# EAGLE schematic ClimbingWallController (EAGLE 6.4)
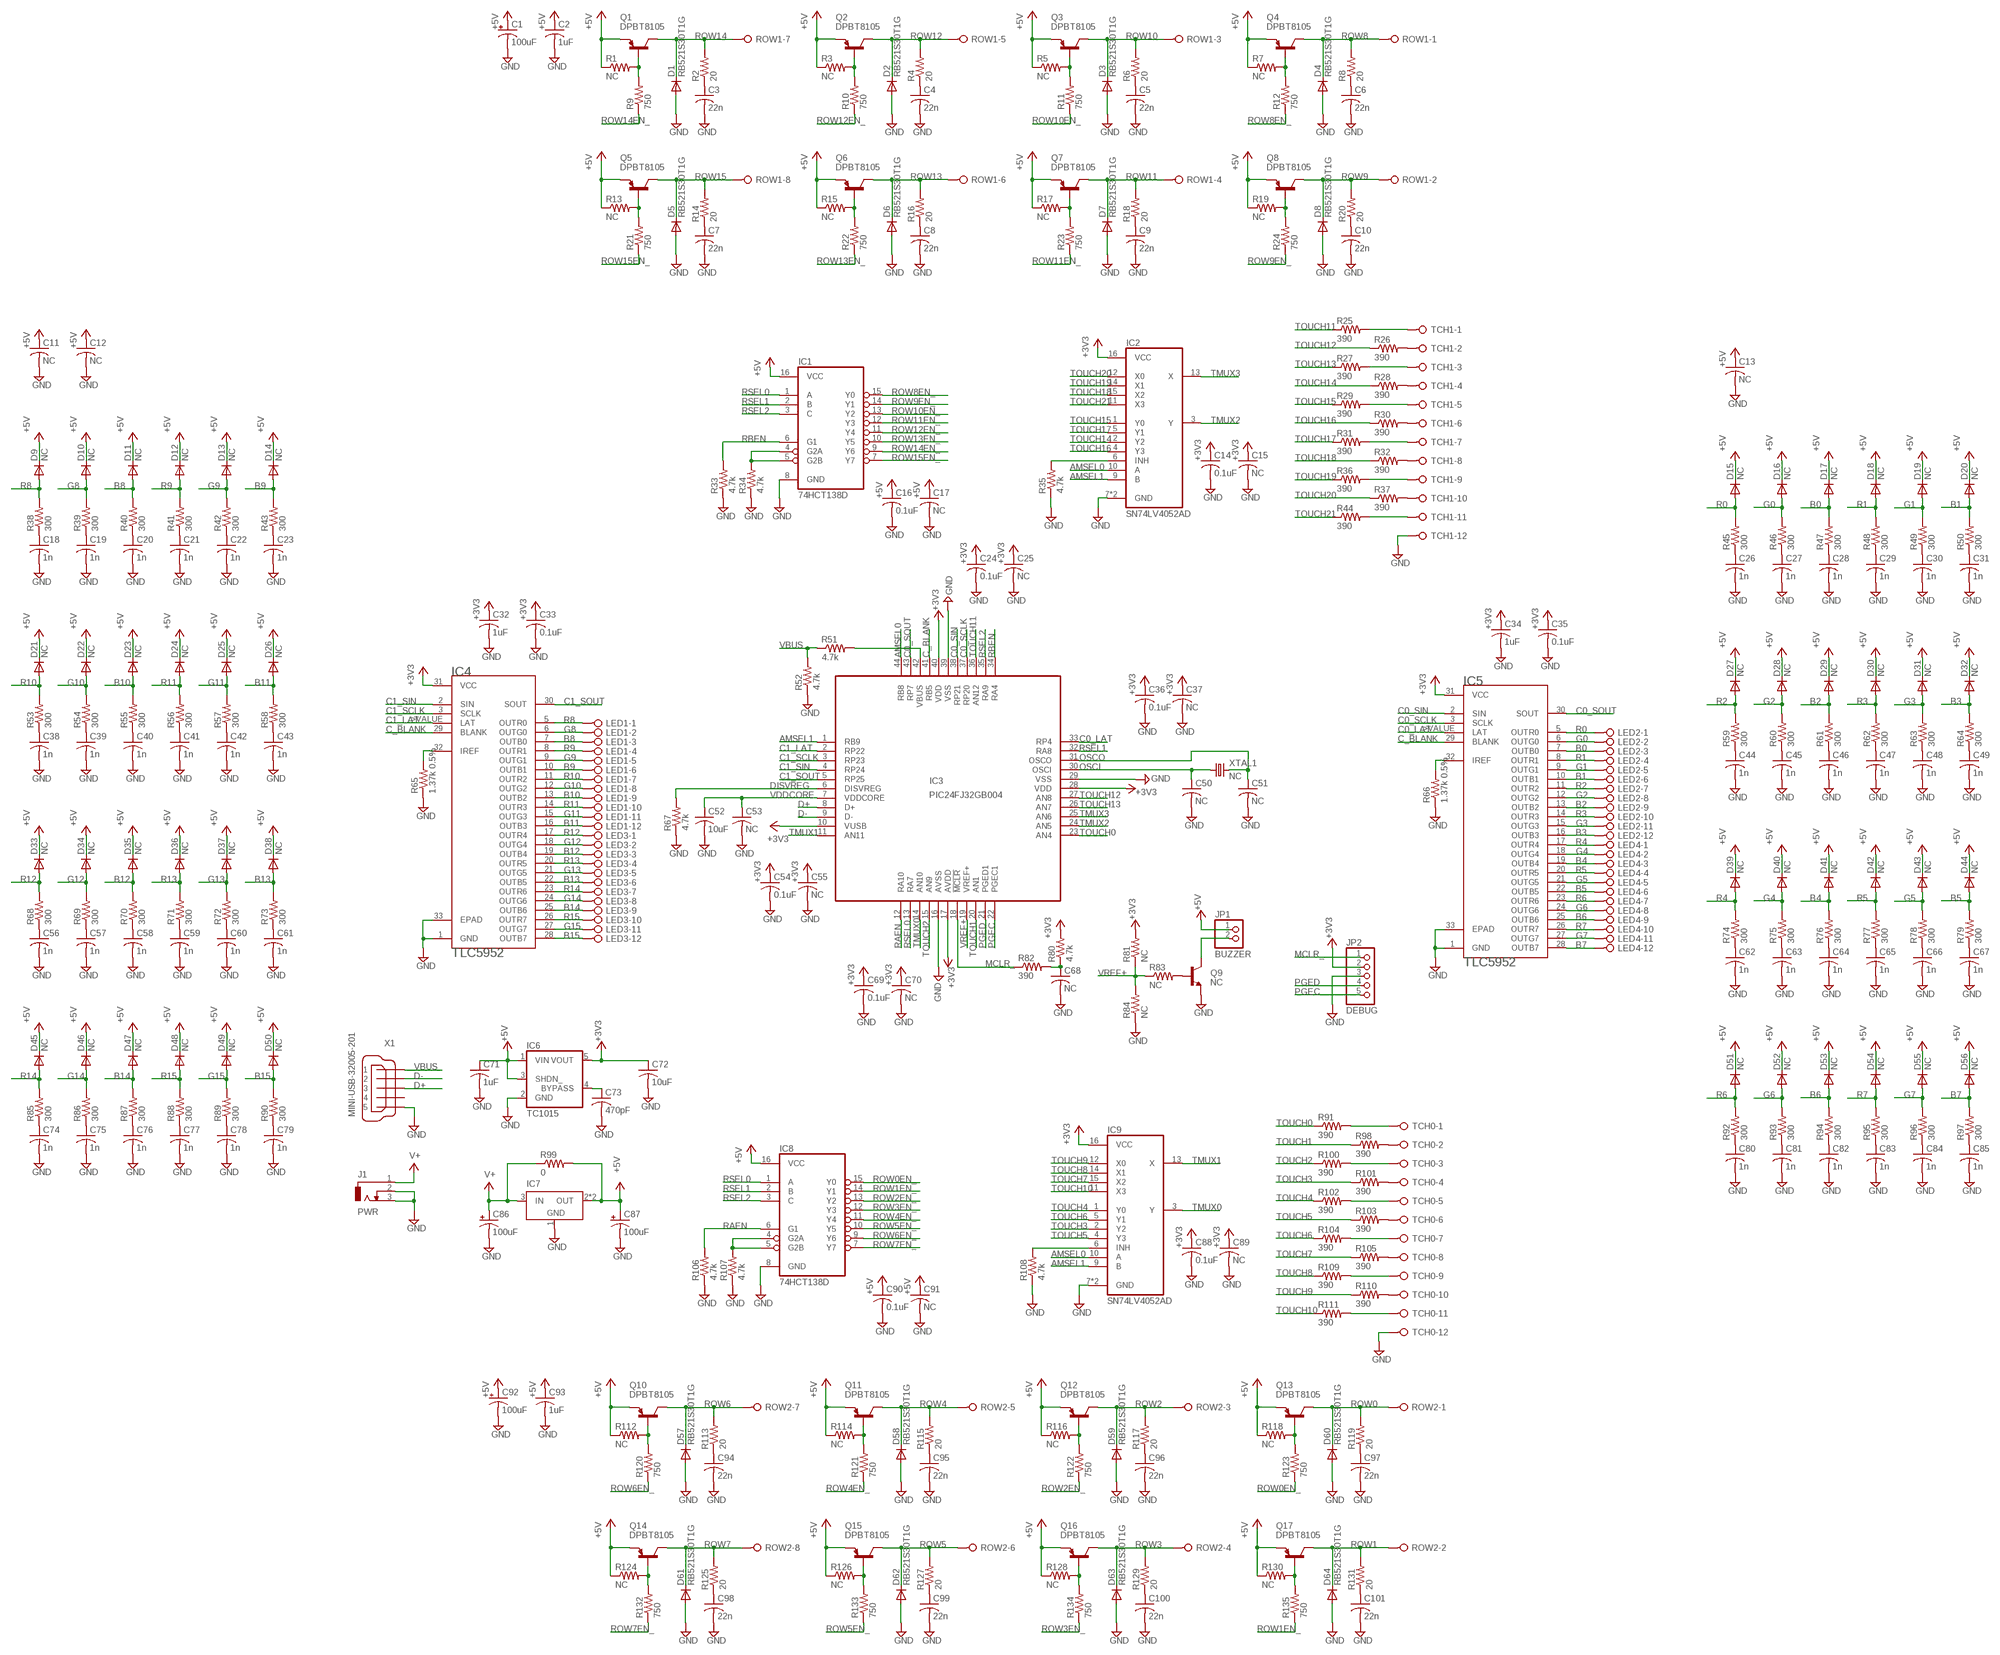
[diagram p0: schematic, sheet 1]

## Parts
C1  100uF  CPOL-USD  [PANASONIC_D]
C2  1uF  C-USC0603K  [C0603K]
C3  22n  C-USC0603K  [C0603K]
C4  22n  C-USC0603K  [C0603K]
C5  22n  C-USC0603K  [C0603K]
C6  22n  C-USC0603K  [C0603K]
C7  22n  C-USC0603K  [C0603K]
C8  22n  C-USC0603K  [C0603K]
C9  22n  C-USC0603K  [C0603K]
C10  22n  C-USC0603K  [C0603K]
C11  NC  C-USC0603K  [C0603K]
C12  NC  C-USC0603K  [C0603K]
C13  NC  C-USC0603K  [C0603K]
C14  0.1uF  C-USC0603K  [C0603K]
C15  NC  C-USC0603K  [C0603K]
C16  0.1uF  C-USC0603K  [C0603K]
C17  NC  C-USC0603K  [C0603K]
C18  1n  C-USC0603K  [C0603K]
C19  1n  C-USC0603K  [C0603K]
C20  1n  C-USC0603K  [C0603K]
C21  1n  C-USC0603K  [C0603K]
C22  1n  C-USC0603K  [C0603K]
C23  1n  C-USC0603K  [C0603K]
C24  0.1uF  C-USC0603K  [C0603K]
C25  NC  C-USC0603K  [C0603K]
C26  1n  C-USC0603K  [C0603K]
C27  1n  C-USC0603K  [C0603K]
C28  1n  C-USC0603K  [C0603K]
C29  1n  C-USC0603K  [C0603K]
C30  1n  C-USC0603K  [C0603K]
C31  1n  C-USC0603K  [C0603K]
C32  1uF  C-USC0603K  [C0603K]
C33  0.1uF  C-USC0603K  [C0603K]
C34  1uF  C-USC0603K  [C0603K]
C35  0.1uF  C-USC0603K  [C0603K]
C36  0.1uF  C-USC0603K  [C0603K]
C37  NC  C-USC0603K  [C0603K]
C38  1n  C-USC0603K  [C0603K]
C39  1n  C-USC0603K  [C0603K]
C40  1n  C-USC0603K  [C0603K]
C41  1n  C-USC0603K  [C0603K]
C42  1n  C-USC0603K  [C0603K]
C43  1n  C-USC0603K  [C0603K]
C44  1n  C-USC0603K  [C0603K]
C45  1n  C-USC0603K  [C0603K]
C46  1n  C-USC0603K  [C0603K]
C47  1n  C-USC0603K  [C0603K]
C48  1n  C-USC0603K  [C0603K]
C49  1n  C-USC0603K  [C0603K]
C50  NC  C-USC0603K  [C0603K]
C51  NC  C-USC0603K  [C0603K]
C52  10uF  C-USC1206K  [C1206K]
C53  NC  C-USC0603K  [C0603K]
C54  0.1uF  C-USC0603K  [C0603K]
C55  NC  C-USC0603K  [C0603K]
C56  1n  C-USC0603K  [C0603K]
C57  1n  C-USC0603K  [C0603K]
C58  1n  C-USC0603K  [C0603K]
C59  1n  C-USC0603K  [C0603K]
C60  1n  C-USC0603K  [C0603K]
C61  1n  C-USC0603K  [C0603K]
C62  1n  C-USC0603K  [C0603K]
C63  1n  C-USC0603K  [C0603K]
C64  1n  C-USC0603K  [C0603K]
C65  1n  C-USC0603K  [C0603K]
C66  1n  C-USC0603K  [C0603K]
C67  1n  C-USC0603K  [C0603K]
C68  NC  C-USC0603K  [C0603K]
C69  0.1uF  C-USC0603K  [C0603K]
C70  NC  C-USC0603K  [C0603K]
C71  1uF  C-USC0603K  [C0603K]
C72  10uF  C-USC1206K  [C1206K]
C73  470pF  C-USC0603K  [C0603K]
C74  1n  C-USC0603K  [C0603K]
C75  1n  C-USC0603K  [C0603K]
C76  1n  C-USC0603K  [C0603K]
C77  1n  C-USC0603K  [C0603K]
C78  1n  C-USC0603K  [C0603K]
C79  1n  C-USC0603K  [C0603K]
C80  1n  C-USC0603K  [C0603K]
C81  1n  C-USC0603K  [C0603K]
C82  1n  C-USC0603K  [C0603K]
C83  1n  C-USC0603K  [C0603K]
C84  1n  C-USC0603K  [C0603K]
C85  1n  C-USC0603K  [C0603K]
C86  100uF  CPOL-USD  [PANASONIC_D]
C87  100uF  CPOL-USD  [PANASONIC_D]
C88  0.1uF  C-USC0603K  [C0603K]
C89  NC  C-USC0603K  [C0603K]
C90  0.1uF  C-USC0603K  [C0603K]
C91  NC  C-USC0603K  [C0603K]
C92  100uF  CPOL-USD  [PANASONIC_D]
C93  1uF  C-USC0603K  [C0603K]
C94  22n  C-USC0603K  [C0603K]
C95  22n  C-USC0603K  [C0603K]
C96  22n  C-USC0603K  [C0603K]
C97  22n  C-USC0603K  [C0603K]
C98  22n  C-USC0603K  [C0603K]
C99  22n  C-USC0603K  [C0603K]
C100  22n  C-USC0603K  [C0603K]
C101  22n  C-USC0603K  [C0603K]
D1  RB521S30T1G  DIODE-SOD523  [SOD523]
D2  RB521S30T1G  DIODE-SOD523  [SOD523]
D3  RB521S30T1G  DIODE-SOD523  [SOD523]
D4  RB521S30T1G  DIODE-SOD523  [SOD523]
D5  RB521S30T1G  DIODE-SOD523  [SOD523]
D6  RB521S30T1G  DIODE-SOD523  [SOD523]
D7  RB521S30T1G  DIODE-SOD523  [SOD523]
D8  RB521S30T1G  DIODE-SOD523  [SOD523]
D9  NC  DIODE-SOD523  [SOD523]
D10  NC  DIODE-SOD523  [SOD523]
D11  NC  DIODE-SOD523  [SOD523]
D12  NC  DIODE-SOD523  [SOD523]
D13  NC  DIODE-SOD523  [SOD523]
D14  NC  DIODE-SOD523  [SOD523]
D15  NC  DIODE-SOD523  [SOD523]
D16  NC  DIODE-SOD523  [SOD523]
D17  NC  DIODE-SOD523  [SOD523]
D18  NC  DIODE-SOD523  [SOD523]
D19  NC  DIODE-SOD523  [SOD523]
D20  NC  DIODE-SOD523  [SOD523]
D21  NC  DIODE-SOD523  [SOD523]
D22  NC  DIODE-SOD523  [SOD523]
D23  NC  DIODE-SOD523  [SOD523]
D24  NC  DIODE-SOD523  [SOD523]
D25  NC  DIODE-SOD523  [SOD523]
D26  NC  DIODE-SOD523  [SOD523]
D27  NC  DIODE-SOD523  [SOD523]
D28  NC  DIODE-SOD523  [SOD523]
D29  NC  DIODE-SOD523  [SOD523]
D30  NC  DIODE-SOD523  [SOD523]
D31  NC  DIODE-SOD523  [SOD523]
D32  NC  DIODE-SOD523  [SOD523]
D33  NC  DIODE-SOD523  [SOD523]
D34  NC  DIODE-SOD523  [SOD523]
D35  NC  DIODE-SOD523  [SOD523]
D36  NC  DIODE-SOD523  [SOD523]
D37  NC  DIODE-SOD523  [SOD523]
D38  NC  DIODE-SOD523  [SOD523]
D39  NC  DIODE-SOD523  [SOD523]
D40  NC  DIODE-SOD523  [SOD523]
D41  NC  DIODE-SOD523  [SOD523]
D42  NC  DIODE-SOD523  [SOD523]
D43  NC  DIODE-SOD523  [SOD523]
D44  NC  DIODE-SOD523  [SOD523]
D45  NC  DIODE-SOD523  [SOD523]
D46  NC  DIODE-SOD523  [SOD523]
D47  NC  DIODE-SOD523  [SOD523]
D48  NC  DIODE-SOD523  [SOD523]
D49  NC  DIODE-SOD523  [SOD523]
D50  NC  DIODE-SOD523  [SOD523]
D51  NC  DIODE-SOD523  [SOD523]
D52  NC  DIODE-SOD523  [SOD523]
D53  NC  DIODE-SOD523  [SOD523]
D54  NC  DIODE-SOD523  [SOD523]
D55  NC  DIODE-SOD523  [SOD523]
D56  NC  DIODE-SOD523  [SOD523]
D57  RB521S30T1G  DIODE-SOD523  [SOD523]
D58  RB521S30T1G  DIODE-SOD523  [SOD523]
D59  RB521S30T1G  DIODE-SOD523  [SOD523]
D60  RB521S30T1G  DIODE-SOD523  [SOD523]
D61  RB521S30T1G  DIODE-SOD523  [SOD523]
D62  RB521S30T1G  DIODE-SOD523  [SOD523]
D63  RB521S30T1G  DIODE-SOD523  [SOD523]
D64  RB521S30T1G  DIODE-SOD523  [SOD523]
IC1  74HCT138D  [SO16]
IC2  SN74LV4052AD  [SO16]
IC3  PIC24FJ32GB004  [TQFP44]
IC4  TLC5952  [HTSSOP-32POWERPAD]
IC5  TLC5952  [HTSSOP-32POWERPAD]
IC6  TC1015  [SOT23-5L]
IC7  NCP1117  [SOT223]
IC8  74HCT138D  [SO16]
IC9  SN74LV4052AD  [SO16]
J1  PWR  DCJ0303  [DCJ0303]
JP1  BUZZER  PINHD-1X2  [1X02]
JP2  DEBUG  PINHD-1X5  [1X05]
LED1  OSTVN12A150  [OSTVN12]
LED2  OSTVN12A150  [OSTVN12]
LED3  OSTVN12A150  [OSTVN12]
LED4  OSTVN12A150  [OSTVN12]
Q1  DPBT8105  [SOT23]
Q2  DPBT8105  [SOT23]
Q3  DPBT8105  [SOT23]
Q4  DPBT8105  [SOT23]
Q5  DPBT8105  [SOT23]
Q6  DPBT8105  [SOT23]
Q7  DPBT8105  [SOT23]
Q8  DPBT8105  [SOT23]
Q9  NC  BC847A-NPN-SOT23-BEC  [SOT23-BEC]
Q10  DPBT8105  [SOT23]
Q11  DPBT8105  [SOT23]
Q12  DPBT8105  [SOT23]
Q13  DPBT8105  [SOT23]
Q14  DPBT8105  [SOT23]
Q15  DPBT8105  [SOT23]
Q16  DPBT8105  [SOT23]
Q17  DPBT8105  [SOT23]
R1  NC  R-US_R0603  [R0603]
R2  20  R-US_R0603  [R0603]
R3  NC  R-US_R0603  [R0603]
R4  20  R-US_R0603  [R0603]
R5  NC  R-US_R0603  [R0603]
R6  20  R-US_R0603  [R0603]
R7  NC  R-US_R0603  [R0603]
R8  20  R-US_R0603  [R0603]
R9  750  R-US_R0603  [R0603]
R10  750  R-US_R0603  [R0603]
R11  750  R-US_R0603  [R0603]
R12  750  R-US_R0603  [R0603]
R13  NC  R-US_R0603  [R0603]
R14  20  R-US_R0603  [R0603]
R15  NC  R-US_R0603  [R0603]
R16  20  R-US_R0603  [R0603]
R17  NC  R-US_R0603  [R0603]
R18  20  R-US_R0603  [R0603]
R19  NC  R-US_R0603  [R0603]
R20  20  R-US_R0603  [R0603]
R21  750  R-US_R0603  [R0603]
R22  750  R-US_R0603  [R0603]
R23  750  R-US_R0603  [R0603]
R24  750  R-US_R0603  [R0603]
R25  390  R-US_R0603  [R0603]
R26  390  R-US_R0603  [R0603]
R27  390  R-US_R0603  [R0603]
R28  390  R-US_R0603  [R0603]
R29  390  R-US_R0603  [R0603]
R30  390  R-US_R0603  [R0603]
R31  390  R-US_R0603  [R0603]
R32  390  R-US_R0603  [R0603]
R33  4.7k  R-US_R0603  [R0603]
R34  4.7k  R-US_R0603  [R0603]
R35  4.7k  R-US_R0603  [R0603]
R36  390  R-US_R0603  [R0603]
R37  390  R-US_R0603  [R0603]
R38  300  R-US_R0603  [R0603]
R39  300  R-US_R0603  [R0603]
R40  300  R-US_R0603  [R0603]
R41  300  R-US_R0603  [R0603]
R42  300  R-US_R0603  [R0603]
R43  300  R-US_R0603  [R0603]
R44  390  R-US_R0603  [R0603]
R45  300  R-US_R0603  [R0603]
R46  300  R-US_R0603  [R0603]
R47  300  R-US_R0603  [R0603]
R48  300  R-US_R0603  [R0603]
R49  300  R-US_R0603  [R0603]
R50  300  R-US_R0603  [R0603]
R51  4.7k  R-US_R0603  [R0603]
R52  4.7k  R-US_R0603  [R0603]
R53  300  R-US_R0603  [R0603]
R54  300  R-US_R0603  [R0603]
R55  300  R-US_R0603  [R0603]
R56  300  R-US_R0603  [R0603]
R57  300  R-US_R0603  [R0603]
R58  300  R-US_R0603  [R0603]
R59  300  R-US_R0603  [R0603]
R60  300  R-US_R0603  [R0603]
R61  300  R-US_R0603  [R0603]
R62  300  R-US_R0603  [R0603]
R63  300  R-US_R0603  [R0603]
R64  300  R-US_R0603  [R0603]
R65  1.37k 0.5%  R-US_R0805  [R0805]
R66  1.37k 0.5%  R-US_R0805  [R0805]
R67  4.7k  R-US_R0603  [R0603]
R68  300  R-US_R0603  [R0603]
R69  300  R-US_R0603  [R0603]
R70  300  R-US_R0603  [R0603]
R71  300  R-US_R0603  [R0603]
R72  300  R-US_R0603  [R0603]
R73  300  R-US_R0603  [R0603]
R74  300  R-US_R0603  [R0603]
R75  300  R-US_R0603  [R0603]
R76  300  R-US_R0603  [R0603]
R77  300  R-US_R0603  [R0603]
R78  300  R-US_R0603  [R0603]
R79  300  R-US_R0603  [R0603]
R80  4.7k  R-US_R0603  [R0603]
R81  NC  R-US_R0603  [R0603]
R82  390  R-US_R0603  [R0603]
R83  NC  R-US_R0603  [R0603]
R84  NC  R-US_R0603  [R0603]
R85  300  R-US_R0603  [R0603]
R86  300  R-US_R0603  [R0603]
R87  300  R-US_R0603  [R0603]
R88  300  R-US_R0603  [R0603]
R89  300  R-US_R0603  [R0603]
R90  300  R-US_R0603  [R0603]
R91  390  R-US_R0603  [R0603]
R92  300  R-US_R0603  [R0603]
R93  300  R-US_R0603  [R0603]
R94  300  R-US_R0603  [R0603]
R95  300  R-US_R0603  [R0603]
R96  300  R-US_R0603  [R0603]
R97  300  R-US_R0603  [R0603]
R98  390  R-US_R0603  [R0603]
R99  0  R-US_R0805  [R0805]
R100  390  R-US_R0603  [R0603]
R101  390  R-US_R0603  [R0603]
R102  390  R-US_R0603  [R0603]
R103  390  R-US_R0603  [R0603]
R104  390  R-US_R0603  [R0603]
R105  390  R-US_R0603  [R0603]
R106  4.7k  R-US_R0603  [R0603]
R107  4.7k  R-US_R0603  [R0603]
R108  4.7k  R-US_R0603  [R0603]
R109  390  R-US_R0603  [R0603]
R110  390  R-US_R0603  [R0603]
R111  390  R-US_R0603  [R0603]
R112  NC  R-US_R0603  [R0603]
R113  20  R-US_R0603  [R0603]
R114  NC  R-US_R0603  [R0603]
R115  20  R-US_R0603  [R0603]
R116  NC  R-US_R0603  [R0603]
R117  20  R-US_R0603  [R0603]
R118  NC  R-US_R0603  [R0603]
R119  20  R-US_R0603  [R0603]
R120  750  R-US_R0603  [R0603]
R121  750  R-US_R0603  [R0603]
R122  750  R-US_R0603  [R0603]
R123  750  R-US_R0603  [R0603]
R124  NC  R-US_R0603  [R0603]
R125  20  R-US_R0603  [R0603]
R126  NC  R-US_R0603  [R0603]
R127  20  R-US_R0603  [R0603]
R128  NC  R-US_R0603  [R0603]
R129  20  R-US_R0603  [R0603]
R130  NC  R-US_R0603  [R0603]
R131  20  R-US_R0603  [R0603]
R132  750  R-US_R0603  [R0603]
R133  750  R-US_R0603  [R0603]
R134  750  R-US_R0603  [R0603]
R135  750  R-US_R0603  [R0603]
ROW1  OSTVN08A150  [OSTVN08]
ROW2  OSTVN08A150  [OSTVN08]
TCH0  OSTVN12A150  [OSTVN12]
TCH1  OSTVN12A150  [OSTVN12]
X1  MINI-USB-32005-201  [32005-201]
XTAL1  NC  CRY5032  [NX5032]

## Nets
+3V3: C14.1 C15.1 C24.1 C25.1 C32.1 C33.1 C34.1 C35.1 C36.1 C37.1 C54.1 C55.1 C69.1 C70.1 C72.1 C88.1 C89.1 IC2.16(VCC) IC3.10(VUSB) IC3.17(AVDD) IC3.28(VDD) IC3.40(VDD) IC4.31(VCC) IC5.31(VCC) IC6.5(VOUT) IC9.16(VCC) JP2.2 R80.2 R81.2
+5V: C1.+ C2.1 C11.1 C12.1 C13.1 C16.1 C17.1 C71.1 C87.+ C90.1 C91.1 C92.+ C93.1 D9.C D10.C D11.C D12.C D13.C D14.C D15.C D16.C D17.C D18.C D19.C D20.C D21.C D22.C D23.C D24.C D25.C D26.C D27.C D28.C D29.C D30.C D31.C D32.C D33.C D34.C D35.C D36.C D37.C D38.C D39.C D40.C D41.C D42.C D43.C D44.C D45.C D46.C D47.C D48.C D49.C D50.C D51.C D52.C D53.C D54.C D55.C D56.C IC1.16(VCC) IC6.1(VIN) IC6.3(SHDN_) IC7.2(OUT) IC7.4(OUT) IC8.16(VCC) JP1.1 Q1.2(E) Q2.2(E) Q3.2(E) Q4.2(E) Q5.2(E) Q6.2(E) Q7.2(E) Q8.2(E) Q10.2(E) Q11.2(E) Q12.2(E) Q13.2(E) Q14.2(E) Q15.2(E) Q16.2(E) Q17.2(E) R1.1 R3.1 R5.1 R7.1 R13.1 R15.1 R17.1 R19.1 R99.2 R112.1 R114.1 R116.1 R118.1 R124.1 R126.1 R128.1 R130.1
AMSEL0: IC2.10(A) IC3.44(RB8) IC9.10(A)
AMSEL1: IC2.9(B) IC3.1(RB9) IC9.9(B)
B0: D17.A IC5.7(OUTB0) LED2.3 R47.2
B1: D20.A IC5.10(OUTB1) LED2.6 R50.2
B2: D29.A IC5.13(OUTB2) LED2.9 R61.2
B3: D32.A IC5.16(OUTB3) LED2.12 R64.2
B4: D41.A IC5.19(OUTB4) LED4.3 R76.2
B5: D44.A IC5.22(OUTB5) LED4.6 R79.2
B6: D53.A IC5.25(OUTB6) LED4.9 R94.2
B7: D56.A IC5.28(OUTB7) LED4.12 R97.2
B8: D11.A IC4.7(OUTB0) LED1.3 R40.2
B9: D14.A IC4.10(OUTB1) LED1.6 R43.2
B10: D23.A IC4.13(OUTB2) LED1.9 R55.2
B11: D26.A IC4.16(OUTB3) LED1.12 R58.2
B12: D35.A IC4.19(OUTB4) LED3.3 R70.2
B13: D38.A IC4.22(OUTB5) LED3.6 R73.2
B14: D47.A IC4.25(OUTB6) LED3.9 R87.2
B15: D50.A IC4.28(OUTB7) LED3.12 R90.2
C0_LAT: IC3.33(RP4) IC5.>VALUE(LAT)
C0_SCLK: IC3.37(RP20) IC5.3(SCLK)
C0_SIN: IC3.38(RP21) IC5.2(SIN)
C0_SOUT: IC3.43(RP7) IC5.30(SOUT)
C1_LAT: IC3.2(RP22) IC4.>VALUE(LAT)
C1_SCLK: IC3.3(RP23) IC4.3(SCLK)
C1_SIN: IC3.4(RP24) IC4.2(SIN)
C1_SOUT: IC3.5(RP25) IC4.30(SOUT)
C_BLANK: IC3.41(RB5) IC4.29(BLANK) IC5.29(BLANK)
CAIREF: IC5.32(IREF) R66.2
CAIREF1: IC4.32(IREF) R65.2
D+: IC3.8(D+) X1.3
D-: IC3.9(D-) X1.2
DISVREG: IC3.6(DISVREG) R67.2
G0: D16.A IC5.6(OUTG0) LED2.2 R46.2
G1: D19.A IC5.9(OUTG1) LED2.5 R49.2
G2: D28.A IC5.12(OUTG2) LED2.8 R60.2
G3: D31.A IC5.15(OUTG3) LED2.11 R63.2
G4: D40.A IC5.18(OUTG4) LED4.2 R75.2
G5: D43.A IC5.21(OUTG5) LED4.5 R78.2
G6: D52.A IC5.24(OUTG6) LED4.8 R93.2
G7: D55.A IC5.27(OUTG7) LED4.11 R96.2
G8: D10.A IC4.6(OUTG0) LED1.2 R39.2
G9: D13.A IC4.9(OUTG1) LED1.5 R42.2
G10: D22.A IC4.12(OUTG2) LED1.8 R54.2
G11: D25.A IC4.15(OUTG3) LED1.11 R57.2
G12: D34.A IC4.18(OUTG4) LED3.2 R69.2
G13: D37.A IC4.21(OUTG5) LED3.5 R72.2
G14: D46.A IC4.24(OUTG6) LED3.8 R86.2
G15: D49.A IC4.27(OUTG7) LED3.11 R89.2
GND: C1.- C2.2 C3.2 C4.2 C5.2 C6.2 C7.2 C8.2 C9.2 C10.2 C11.2 C12.2 C13.2 C14.2 C15.2 C16.2 C17.2 C18.2 C19.2 C20.2 C21.2 C22.2 C23.2 C24.2 C25.2 C26.2 C27.2 C28.2 C29.2 C30.2 C31.2 C32.2 C33.2 C34.2 C35.2 C36.2 C37.2 C38.2 C39.2 C40.2 C41.2 C42.2 C43.2 C44.2 C45.2 C46.2 C47.2 C48.2 C49.2 C50.2 C51.2 C52.2 C53.2 C54.2 C55.2 C56.2 C57.2 C58.2 C59.2 C60.2 C61.2 C62.2 C63.2 C64.2 C65.2 C66.2 C67.2 C68.2 C69.2 C70.2 C71.2 C72.2 C73.2 C74.2 C75.2 C76.2 C77.2 C78.2 C79.2 C80.2 C81.2 C82.2 C83.2 C84.2 C85.2 C86.- C87.- C88.2 C89.2 C90.2 C91.2 C92.- C93.2 C94.2 C95.2 C96.2 C97.2 C98.2 C99.2 C100.2 C101.2 D1.A D2.A D3.A D4.A D5.A D6.A D7.A D8.A D57.A D58.A D59.A D60.A D61.A D62.A D63.A D64.A IC1.8(GND) IC2.7(GND) IC2.8(GND) IC3.16(AVSS) IC3.29(VSS) IC3.39(VSS) IC4.1(GND) IC4.33(EPAD) IC5.1(GND) IC5.33(EPAD) IC6.2(GND) IC7.1(GND) IC8.8(GND) IC9.7(GND) IC9.8(GND) J1.2 J1.3 JP2.3 Q9.E R33.1 R34.1 R35.1 R52.1 R65.1 R66.1 R67.1 R84.1 R106.1 R107.1 R108.1 TCH0.12 TCH1.12 X1.5
MCLR_: IC3.18(!MCLR) JP2.1 R82.1
N$1: Q13.1(B) R118.2 R123.2
N$2: C97.1 R119.1
N$3: Q12.1(B) R116.2 R122.2
N$4: C96.1 R117.1
N$5: Q16.1(B) R128.2 R134.2
N$6: C100.1 R129.1
N$7: Q15.1(B) R126.2 R133.2
N$8: C99.1 R127.1
N$9: Q11.1(B) R114.2 R121.2
N$10: C95.1 R115.1
N$11: Q10.1(B) R112.2 R120.2
N$12: C94.1 R113.1
N$13: Q14.1(B) R124.2 R132.2
N$14: C98.1 R125.1
N$15: Q8.1(B) R19.2 R24.2
N$16: C10.1 R20.1
N$17: Q4.1(B) R7.2 R12.2
N$18: C6.1 R8.1
N$19: Q3.1(B) R5.2 R11.2
N$20: C5.1 R6.1
N$21: Q7.1(B) R17.2 R23.2
N$22: C9.1 R18.1
N$23: Q6.1(B) R15.2 R22.2
N$24: C8.1 R16.1
N$25: Q2.1(B) R3.2 R10.2
N$26: C4.1 R4.1
N$27: Q1.1(B) R1.2 R9.2
N$28: C3.1 R2.1
N$29: Q5.1(B) R13.2 R21.2
N$30: C7.1 R14.1
N$31: R98.2 TCH0.2
N$32: R101.2 TCH0.4
N$33: Q17.1(B) R130.2 R135.2
N$34: C101.1 R131.1
N$35: R103.2 TCH0.6
N$36: R105.2 TCH0.8
N$37: R110.2 TCH0.10
N$38: R26.2 TCH1.2
N$39: R28.2 TCH1.4
N$40: R30.2 TCH1.6
N$41: IC8.4(G2A) IC8.5(G2B) R107.2
N$42: IC9.6(INH) R108.2
N$43: IC1.4(G2A) IC1.5(G2B) R34.2
N$44: IC2.6(INH) R35.2
N$45: IC3.42(VBUS) R51.2
N$46: C68.1 R80.1 R82.2
N$47: R91.2 TCH0.1
N$48: R32.2 TCH1.8
N$49: R37.2 TCH1.10
N$50: Q9.B R83.2
N$65: R100.2 TCH0.3
N$67: R102.2 TCH0.5
N$69: R104.2 TCH0.7
N$71: R109.2 TCH0.9
N$73: R111.2 TCH0.11
N$79: R25.2 TCH1.1
N$80: R27.2 TCH1.3
N$81: R29.2 TCH1.5
N$82: R31.2 TCH1.7
N$83: R36.2 TCH1.9
N$84: R44.2 TCH1.11
N$85: C73.1 IC6.4(BYPASS)
N$88: JP1.2 Q9.C
N$89: C26.1 R45.1
N$90: C27.1 R46.1
N$91: C28.1 R47.1
N$92: C29.1 R48.1
N$93: C30.1 R49.1
N$94: C31.1 R50.1
N$95: C44.1 R59.1
N$96: C45.1 R60.1
N$97: C46.1 R61.1
N$98: C47.1 R62.1
N$99: C48.1 R63.1
N$100: C49.1 R64.1
N$101: C62.1 R74.1
N$102: C63.1 R75.1
N$103: C64.1 R76.1
N$104: C65.1 R77.1
N$105: C66.1 R78.1
N$106: C67.1 R79.1
N$107: C80.1 R92.1
N$108: C81.1 R93.1
N$109: C82.1 R94.1
N$110: C83.1 R95.1
N$111: C84.1 R96.1
N$112: C85.1 R97.1
N$114: C18.1 R38.1
N$116: C19.1 R39.1
N$118: C20.1 R40.1
N$120: C21.1 R41.1
N$122: C22.1 R42.1
N$124: C23.1 R43.1
N$126: C38.1 R53.1
N$128: C39.1 R54.1
N$130: C40.1 R55.1
N$132: C41.1 R56.1
N$134: C42.1 R57.1
N$136: C43.1 R58.1
N$138: C56.1 R68.1
N$140: C57.1 R69.1
N$142: C58.1 R70.1
N$144: C59.1 R71.1
N$146: C60.1 R72.1
N$148: C61.1 R73.1
N$150: C74.1 R85.1
N$152: C75.1 R86.1
N$154: C76.1 R87.1
N$156: C77.1 R88.1
N$158: C78.1 R89.1
N$160: C79.1 R90.1
OSCI: C50.1 IC3.30(OSCI) XTAL1.P$1
OSCO: C51.1 IC3.31(OSCO) XTAL1.P$2
PGEC: IC3.22(PGEC1) JP2.5
PGED: IC3.21(PGED1) JP2.4
R0: D15.A IC5.5(OUTR0) LED2.1 R45.2
R1: D18.A IC5.8(OUTR1) LED2.4 R48.2
R2: D27.A IC5.11(OUTR2) LED2.7 R59.2
R3: D30.A IC5.14(OUTR3) LED2.10 R62.2
R4: D39.A IC5.17(OUTR4) LED4.1 R74.2
R5: D42.A IC5.20(OUTR5) LED4.4 R77.2
R6: D51.A IC5.23(OUTR6) LED4.7 R92.2
R7: D54.A IC5.26(OUTR7) LED4.10 R95.2
R8: D9.A IC4.5(OUTR0) LED1.1 R38.2
R9: D12.A IC4.8(OUTR1) LED1.4 R41.2
R10: D21.A IC4.11(OUTR2) LED1.7 R53.2
R11: D24.A IC4.14(OUTR3) LED1.10 R56.2
R12: D33.A IC4.17(OUTR4) LED3.1 R68.2
R13: D36.A IC4.20(OUTR5) LED3.4 R71.2
R14: D45.A IC4.23(OUTR6) LED3.7 R85.2
R15: D48.A IC4.26(OUTR7) LED3.10 R88.2
RAEN: IC3.12(RA10) IC8.6(G1) R106.2
RBEN: IC1.6(G1) IC3.34(RA4) R33.2
ROW0: D60.C Q13.3(C) R119.2 ROW2.1
ROW0EN_: IC8.15(Y0) R123.1
ROW1: D64.C Q17.3(C) R131.2 ROW2.2
ROW1EN_: IC8.14(Y1) R135.1
ROW2: D59.C Q12.3(C) R117.2 ROW2.3
ROW2EN_: IC8.13(Y2) R122.1
ROW3: D63.C Q16.3(C) R129.2 ROW2.4
ROW3EN_: IC8.12(Y3) R134.1
ROW4: D58.C Q11.3(C) R115.2 ROW2.5
ROW4EN_: IC8.11(Y4) R121.1
ROW5: D62.C Q15.3(C) R127.2 ROW2.6
ROW5EN_: IC8.10(Y5) R133.1
ROW6: D57.C Q10.3(C) R113.2 ROW2.7
ROW6EN_: IC8.9(Y6) R120.1
ROW7: D61.C Q14.3(C) R125.2 ROW2.8
ROW7EN_: IC8.7(Y7) R132.1
ROW8: D4.C Q4.3(C) R8.2 ROW1.1
ROW8EN_: IC1.15(Y0) R12.1
ROW9: D8.C Q8.3(C) R20.2 ROW1.2
ROW9EN_: IC1.14(Y1) R24.1
ROW10: D3.C Q3.3(C) R6.2 ROW1.3
ROW10EN_: IC1.13(Y2) R11.1
ROW11: D7.C Q7.3(C) R18.2 ROW1.4
ROW11EN_: IC1.12(Y3) R23.1
ROW12: D2.C Q2.3(C) R4.2 ROW1.5
ROW12EN_: IC1.11(Y4) R10.1
ROW13: D6.C Q6.3(C) R16.2 ROW1.6
ROW13EN_: IC1.10(Y5) R22.1
ROW14: D1.C Q1.3(C) R2.2 ROW1.7
ROW14EN_: IC1.9(Y6) R9.1
ROW15: D5.C Q5.3(C) R14.2 ROW1.8
ROW15EN_: IC1.7(Y7) R21.1
RSEL0: IC1.1(A) IC3.13(RA7) IC8.1(A)
RSEL1: IC1.2(B) IC3.32(RA8) IC8.2(B)
RSEL2: IC1.3(C) IC3.35(RA9) IC8.3(C)
TMUX0: IC3.14(AN10) IC9.3(Y)
TMUX1: IC3.11(AN11) IC9.13(X)
TMUX2: IC2.3(Y) IC3.24(AN5)
TMUX3: IC2.13(X) IC3.25(AN6)
TOUCH0: IC3.23(AN4) R91.1
TOUCH1: IC3.20(AN1) R98.1
TOUCH2: IC3.15(AN9) R100.1
TOUCH3: IC9.2(Y2) R101.1
TOUCH4: IC9.1(Y0) R102.1
TOUCH5: IC9.4(Y3) R103.1
TOUCH6: IC9.5(Y1) R104.1
TOUCH7: IC9.15(X2) R105.1
TOUCH8: IC9.14(X1) R109.1
TOUCH9: IC9.12(X0) R110.1
TOUCH10: IC9.11(X3) R111.1
TOUCH11: IC3.36(AN12) R25.1
TOUCH12: IC3.27(AN8) R26.1
TOUCH13: IC3.26(AN7) R27.1
TOUCH14: IC2.2(Y2) R28.1
TOUCH15: IC2.1(Y0) R29.1
TOUCH16: IC2.4(Y3) R30.1
TOUCH17: IC2.5(Y1) R31.1
TOUCH18: IC2.15(X2) R32.1
TOUCH19: IC2.14(X1) R36.1
TOUCH20: IC2.12(X0) R37.1
TOUCH21: IC2.11(X3) R44.1
V+: C86.+ IC7.3(IN) J1.1 R99.1
VBUS: R51.1 R52.2 X1.1
VDDCORE: C52.1 C53.1 IC3.7(VDDCORE)
VREF+: IC3.19(VREF+) R81.1 R83.1 R84.2
Unconnected: X1.4

## Library data of the parts
C1 C86 C87 C92 = resistor:CPOL-US: POLARIZED CAPACITOR, American symbol
C2 C11-C17 C24 C25 C32-C37 C50-C55 C68-C73 C88-C91 C93 = rcl:C-US: CAPACITOR, American symbol
C3-C10 C18-C23 C26-C31 C38-C49 C56-C67 C74-C85 C94-C101 = resistor:C-US: CAPACITOR, American symbol
D1-D64 = diode:DIODE-: DIODE
IC1 IC8 = Parts:74*138: 3-line to 8-line DECODER/DEMULTIPLEXER; MPN: SN74HCT138DR
IC2 IC9 = Parts:SN74LV4052A: Dual 4-channel ANALOG MULTIPLEXER; MPN: SN74LV4052ADR
IC3 = Parts:PIC24FJ32GB004: PIC24FJ32GB004 edit this description Auto generated by make-symbol-device-package-bsdl.ulp Rev. 25 Source: PIC24FJ32GB004.bsd; MPN: PIC24FJ32GB004-E/PT
IC4 IC5 = Parts:TLC5952; MPN: TLC5952DAP
IC6 = Parts:TC1015: 3.3V 100mA LDO from Microchip http://ww1.microchip.com/downloads/en/DeviceDoc/21335e.pdf; MPN: TC1015-3.3VCT713
IC7 = Parts:NCP1117: VOLTAGE REGULATOR with shutdown; MPN: NCP1117ST50T3G
J1 = Parts:DCJ0303: DC POWER JACK Source: DCJ0303.pdf; OC_FARNELL: unknown; OC_NEWARK: unknown
JP1 = pinhead:PINHD-1X2: PIN HEADER
JP2 = pinhead:PINHD-1X5: PIN HEADER
LED1-LED4 TCH0 TCH1 = Parts:OSTVN12A150: OSTVN12A150 0.1" Screw Terminal, 12 Position On Shore Technology, Inc.
Q1-Q8 Q10-Q17 = Parts:DPBT8105: DPBT8105 1A PNP SURFACE MOUNT TRANSISTOR; MPN: DPBT8105-7
Q9 = transistor:*-NPN-: NPN Transistror BF959 corrected 2008.03.06
R1-R64 R67-R98 R100-R135 = Parts:R-US_: RESISTOR, American symbol
R65 R66 = resistor:R-US_: RESISTOR, American symbol; TOLERANCE: 0.5%
R99 = resistor:R-US_: RESISTOR, American symbol
ROW1 ROW2 = Parts:OSTVN08A150: OSTVN08A150 0.1" Screw Terminal, 8 Position On Shore Technology, Inc.
X1 = Parts:MINI-USB-: MINI USB-B Conector Source: www.cypressindustries.com; MPN: USB-M26FTR; OC_FARNELL: unknown; OC_NEWARK: unknown
XTAL1 = Parts:CRY5032: SMD CRYSTAL Source: www.ecsxtal.com .. Crystal 3.6864MHz CSM_7X_DU.PDF; MPN: 7A-12.000MAAJ-T